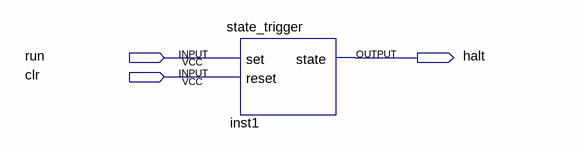
[diagram p0: schematic sheet]
// Quartus schematic EX_HLT.bdf as structural Verilog: 1 symbols, 3 pins
module EX_HLT (
  input  run,
  input  clr,
  output halt
);

  state_trigger inst1 (.set(run), .reset(clr), .state(halt));
endmodule
